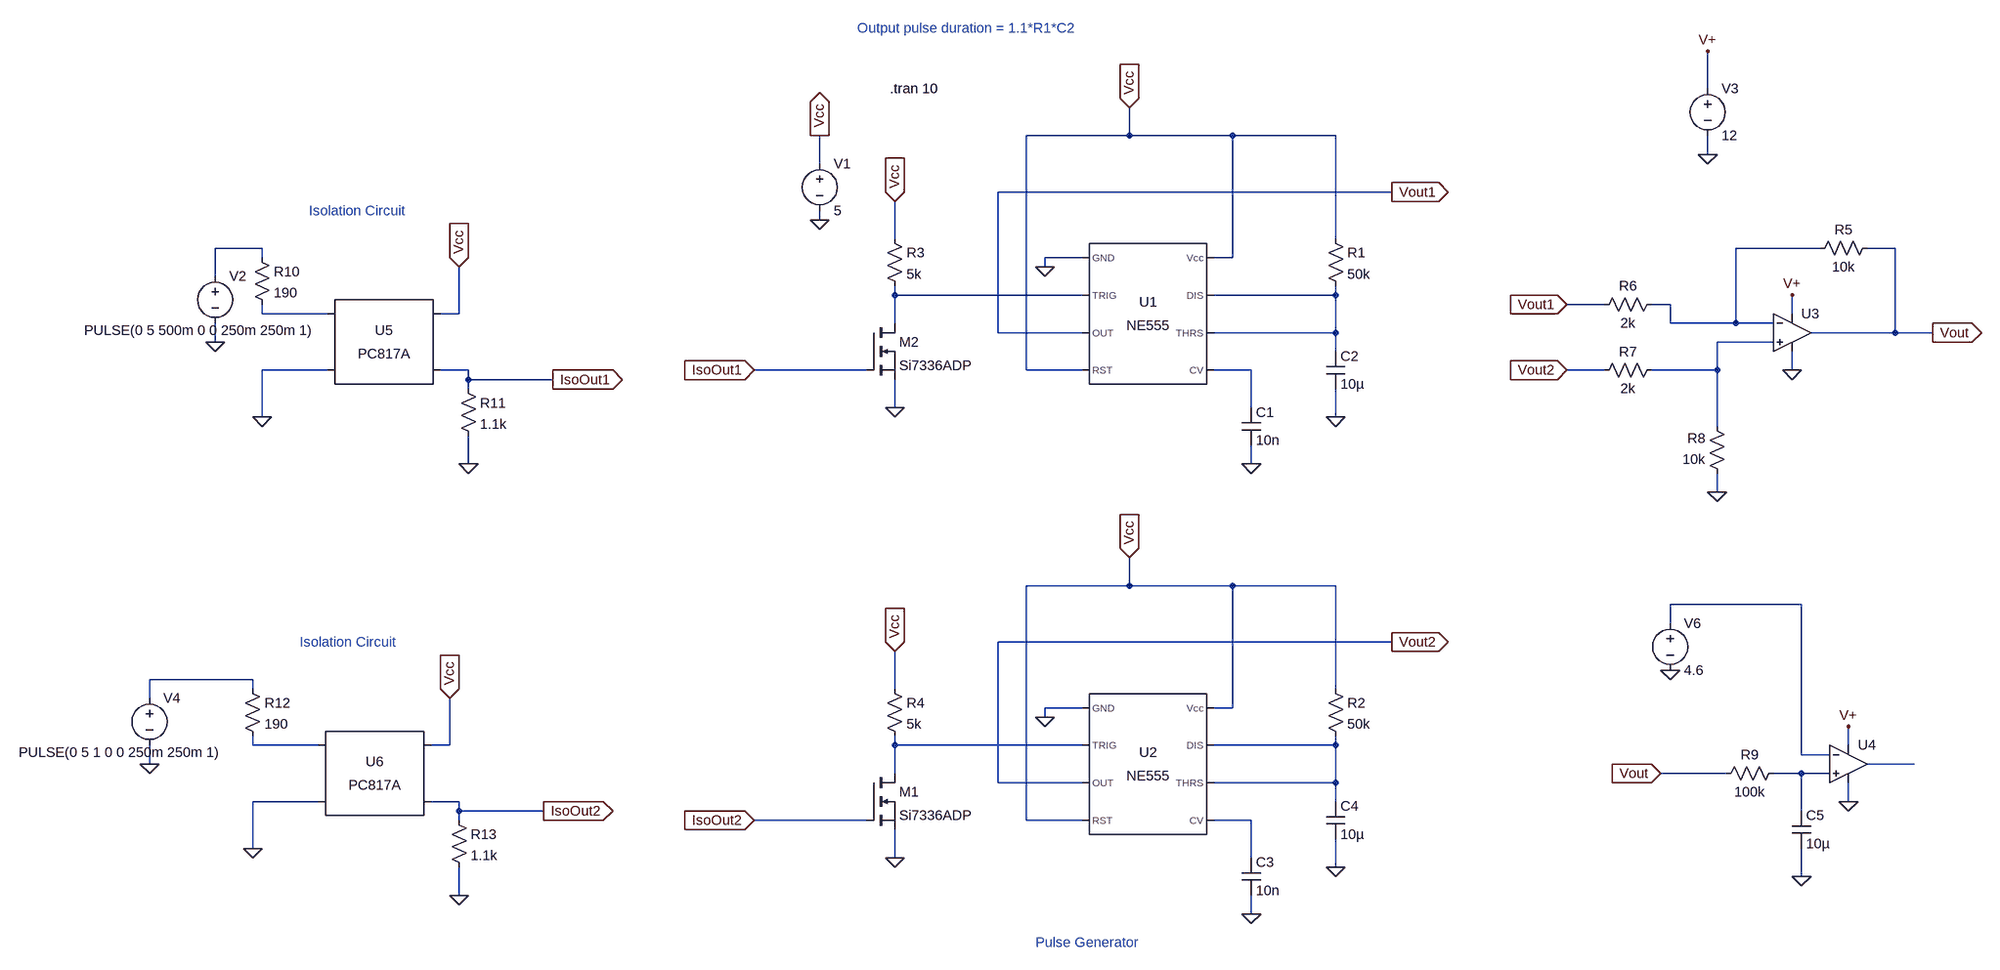
[diagram p0: schematic Relay_Plausibility.asc]
Relay_Plausibility.asc, the LTspice schematic file:
Version 4
SHEET 1 2676 1248
WIRE 1168 -224 1168 -288
WIRE 80 -144 80 -192
WIRE 80 -144 -96 -144
WIRE 256 -144 80 -144
WIRE 432 -144 256 -144
WIRE 1168 -112 1168 -144
WIRE -448 -96 -448 -144
WIRE 528 -48 -144 -48
WIRE -448 0 -448 -16
WIRE -320 32 -320 -32
WIRE 432 32 432 -144
WIRE -1504 48 -1584 48
WIRE 1360 48 1216 48
WIRE 1488 48 1440 48
WIRE -1504 64 -1504 48
WIRE 0 64 -64 64
WIRE 256 64 256 -144
WIRE 256 64 224 64
WIRE -64 80 -64 64
WIRE -1584 96 -1584 48
WIRE -320 128 -320 112
WIRE 0 128 -320 128
WIRE 432 128 432 112
WIRE 432 128 224 128
WIRE 992 144 928 144
WIRE 1104 144 1072 144
WIRE -1504 160 -1504 144
WIRE -1392 160 -1504 160
WIRE -1168 160 -1168 80
WIRE -1168 160 -1200 160
WIRE 1312 160 1312 128
WIRE -320 176 -320 128
WIRE 1104 176 1104 144
WIRE 1216 176 1216 48
WIRE 1216 176 1104 176
WIRE 1280 176 1216 176
WIRE -144 192 -144 -48
WIRE 0 192 -144 192
WIRE 432 192 432 128
WIRE 432 192 224 192
WIRE 1488 192 1488 48
WIRE 1488 192 1344 192
WIRE 1552 192 1488 192
WIRE -1584 208 -1584 176
WIRE 1280 208 1184 208
WIRE 432 224 432 192
WIRE -1392 256 -1504 256
WIRE -1152 256 -1200 256
WIRE -368 256 -560 256
WIRE -96 256 -96 -144
WIRE 0 256 -96 256
WIRE 288 256 224 256
WIRE 992 256 928 256
WIRE 1184 256 1184 208
WIRE 1184 256 1072 256
WIRE 1312 256 1312 224
WIRE -1152 272 -1152 256
WIRE -1008 272 -1152 272
WIRE -1152 288 -1152 272
WIRE -320 320 -320 272
WIRE 288 320 288 256
WIRE -1504 336 -1504 256
WIRE 432 336 432 288
WIRE 1184 352 1184 256
WIRE -1152 416 -1152 368
WIRE 288 416 288 384
WIRE 1184 464 1184 432
WIRE 80 624 80 576
WIRE 80 624 -96 624
WIRE 256 624 80 624
WIRE 432 624 256 624
WIRE 1328 656 1104 656
WIRE 1104 688 1104 656
WIRE 528 720 -144 720
WIRE -1520 784 -1696 784
WIRE -1520 800 -1520 784
WIRE -320 800 -320 736
WIRE 432 800 432 624
WIRE -1696 816 -1696 784
WIRE 0 832 -64 832
WIRE 256 832 256 624
WIRE 256 832 224 832
WIRE -64 848 -64 832
WIRE -1520 896 -1520 880
WIRE -1408 896 -1520 896
WIRE -1184 896 -1184 816
WIRE -1184 896 -1216 896
WIRE -320 896 -320 880
WIRE 0 896 -320 896
WIRE 432 896 432 880
WIRE 432 896 224 896
WIRE 1408 896 1408 864
WIRE 1328 912 1328 656
WIRE 1376 912 1328 912
WIRE -1696 928 -1696 896
WIRE 1520 928 1440 928
WIRE -320 944 -320 896
WIRE 1200 944 1088 944
WIRE 1328 944 1280 944
WIRE 1376 944 1328 944
WIRE -144 960 -144 720
WIRE 0 960 -144 960
WIRE 432 960 432 896
WIRE 432 960 224 960
WIRE -1408 992 -1520 992
WIRE -1168 992 -1216 992
WIRE 432 992 432 960
WIRE 1408 992 1408 960
WIRE -1168 1008 -1168 992
WIRE -1024 1008 -1168 1008
WIRE 1328 1008 1328 944
WIRE -1168 1024 -1168 1008
WIRE -368 1024 -560 1024
WIRE -96 1024 -96 624
WIRE 0 1024 -96 1024
WIRE 288 1024 224 1024
WIRE -1520 1072 -1520 992
WIRE -320 1088 -320 1040
WIRE 288 1088 288 1024
WIRE 432 1104 432 1056
WIRE 1328 1120 1328 1072
WIRE -1168 1152 -1168 1104
WIRE 288 1184 288 1152
FLAG 288 416 0
FLAG -448 0 0
FLAG -448 -144 Vcc
IOPIN -448 -144 Out
FLAG 80 -192 Vcc
IOPIN 80 -192 In
FLAG -64 80 0
FLAG 432 336 0
FLAG -1584 208 0
FLAG 528 -48 Vout1
IOPIN 528 -48 Out
FLAG -320 320 0
FLAG -320 -32 Vcc
IOPIN -320 -32 In
FLAG 288 1184 0
FLAG 80 576 Vcc
IOPIN 80 576 In
FLAG -64 848 0
FLAG 432 1104 0
FLAG -1696 928 0
FLAG 528 720 Vout2
IOPIN 528 720 Out
FLAG -320 1088 0
FLAG -320 736 Vcc
IOPIN -320 736 In
FLAG 1184 464 0
FLAG 928 144 Vout1
IOPIN 928 144 In
FLAG 928 256 Vout2
IOPIN 928 256 In
FLAG 1168 -112 0
FLAG 1168 -288 V+
FLAG 1312 128 V+
FLAG 1552 192 Vout
IOPIN 1552 192 Out
FLAG 1312 256 0
FLAG 1328 1120 0
FLAG 1088 944 Vout
IOPIN 1088 944 In
FLAG 1408 864 V+
FLAG 1408 992 0
FLAG 1104 768 0
FLAG -1504 336 0
FLAG -1168 80 Vcc
IOPIN -1168 80 In
FLAG -1152 416 0
FLAG -1008 272 IsoOut1
IOPIN -1008 272 Out
FLAG -560 256 IsoOut1
IOPIN -560 256 In
FLAG -1520 1072 0
FLAG -1184 816 Vcc
IOPIN -1184 816 In
FLAG -1168 1152 0
FLAG -1024 1008 IsoOut2
IOPIN -1024 1008 Out
FLAG -560 1024 IsoOut2
IOPIN -560 1024 In
SYMBOL Misc\\NE555 112 160 R0
SYMATTR InstName U1
SYMBOL cap 272 320 R0
SYMATTR InstName C1
SYMATTR Value 10n
SYMBOL voltage -448 -112 R0
WINDOW 123 0 0 Left 0
WINDOW 39 0 0 Left 0
SYMATTR InstName V1
SYMATTR Value 5
SYMBOL cap 416 224 R0
SYMATTR InstName C2
SYMATTR Value 10µ
SYMBOL res 416 16 R0
SYMATTR InstName R1
SYMATTR Value 50k
SYMBOL voltage -1584 80 R0
WINDOW 3 -223 108 Left 2
WINDOW 123 0 0 Left 0
WINDOW 39 0 0 Left 0
SYMATTR Value PULSE(0 5 500m 0 0 250m 250m 1)
SYMATTR InstName V2
SYMBOL nmos -368 176 R0
SYMATTR InstName M2
SYMATTR Value Si7336ADP
SYMBOL res -336 16 R0
SYMATTR InstName R3
SYMATTR Value 5k
SYMBOL Misc\\NE555 112 928 R0
SYMATTR InstName U2
SYMBOL cap 272 1088 R0
SYMATTR InstName C3
SYMATTR Value 10n
SYMBOL cap 416 992 R0
SYMATTR InstName C4
SYMATTR Value 10µ
SYMBOL res 416 784 R0
SYMATTR InstName R2
SYMATTR Value 50k
SYMBOL voltage -1696 800 R0
WINDOW 3 -223 108 Left 2
WINDOW 123 0 0 Left 0
WINDOW 39 0 0 Left 0
SYMATTR Value PULSE(0 5 1 0 0 250m 250m 1)
SYMATTR InstName V4
SYMBOL nmos -368 944 R0
SYMATTR InstName M1
SYMATTR Value Si7336ADP
SYMBOL res -336 784 R0
SYMATTR InstName R4
SYMATTR Value 5k
SYMBOL OpAmps\\UniversalOpamp2 1312 192 R0
SYMATTR InstName U3
SYMBOL res 1456 32 R90
WINDOW 0 0 56 VBottom 2
WINDOW 3 32 56 VTop 2
SYMATTR InstName R5
SYMATTR Value 10k
SYMBOL res 1088 128 R90
WINDOW 0 0 56 VBottom 2
WINDOW 3 32 56 VTop 2
SYMATTR InstName R6
SYMATTR Value 2k
SYMBOL res 1088 240 R90
WINDOW 0 0 56 VBottom 2
WINDOW 3 32 56 VTop 2
SYMATTR InstName R7
SYMATTR Value 2k
SYMBOL res 1200 448 R180
WINDOW 0 36 76 Left 2
WINDOW 3 36 40 Left 2
SYMATTR InstName R8
SYMATTR Value 10k
SYMBOL voltage 1168 -240 R0
WINDOW 123 0 0 Left 0
WINDOW 39 0 0 Left 0
SYMATTR InstName V3
SYMATTR Value 12
SYMBOL res 1296 928 R90
WINDOW 0 0 56 VBottom 2
WINDOW 3 32 56 VTop 2
SYMATTR InstName R9
SYMATTR Value 100k
SYMBOL cap 1312 1008 R0
SYMATTR InstName C5
SYMATTR Value 10µ
SYMBOL OpAmps\\UniversalOpamp2 1408 928 R0
SYMATTR InstName U4
SYMBOL voltage 1104 672 R0
WINDOW 123 0 0 Left 0
WINDOW 39 0 0 Left 0
SYMATTR InstName V6
SYMATTR Value 4.6
SYMBOL Optos\\PC817A -1296 208 R0
SYMATTR InstName U5
SYMBOL res -1520 48 R0
SYMATTR InstName R10
SYMATTR Value 190
SYMBOL res -1168 272 R0
SYMATTR InstName R11
SYMATTR Value 1.1k
SYMBOL Optos\\PC817A -1312 944 R0
SYMATTR InstName U6
SYMBOL res -1536 784 R0
SYMATTR InstName R12
SYMATTR Value 190
SYMBOL res -1184 1008 R0
SYMATTR InstName R13
SYMATTR Value 1.1k
TEXT -384 -328 Left 2 ;Output pulse duration = 1.1*R1*C2
TEXT -328 -224 Left 2 !.tran 10
TEXT -1424 -16 Left 2 ;Isolation Circuit
TEXT -1440 720 Left 2 ;Isolation Circuit
TEXT -80 1232 Left 2 ;Pulse Generator

The netlist it stands for:
* Relay_Plausibility.asc
XU1 0 N003 Vout1 Vcc N007 N004 N004 Vcc NE555  ; pins GND TRIG OUT RST CV THRS DIS Vcc
C1 N007 0 10n
V1 Vcc 0 5
C2 N004 0 10µ
R1 Vcc N004 50k
V2 N001 0 PULSE(0 5 500m 0 0 250m 250m 1)
M2 N003 IsoOut1 0 0 Si7336ADP
R3 Vcc N003 5k
XU2 0 N011 Vout2 Vcc N015 N012 N012 Vcc NE555  ; pins GND TRIG OUT RST CV THRS DIS Vcc
C3 N015 0 10n
C4 N012 0 10µ
R2 Vcc N012 50k
V4 N009 0 PULSE(0 5 1 0 0 250m 250m 1)
M1 N011 IsoOut2 0 0 Si7336ADP
R4 Vcc N011 5k
XU3 N006 N002 V+ 0 Vout level.2 Avol=1Meg GBW=10Meg Slew=10Meg ilimit=25m rail=0 Vos=0 phimargin=45 en=0 enk=0 in=0 ink=0 Rin=500Meg  ; pins IN+ IN- V+ V- OUT
R5 Vout N002 10k
R6 N002 Vout1 2k
R7 N006 Vout2 2k
R8 0 N006 10k
V3 V+ 0 12
R9 N014 Vout 100k
C5 N014 0 10µ
XU4 N014 N008 V+ 0 N013 level.2 Avol=1Meg GBW=10Meg Slew=10Meg ilimit=25m rail=0 Vos=0 phimargin=45 en=0 enk=0 in=0 ink=0 Rin=500Meg  ; pins IN+ IN- V+ V- OUT
V6 N008 0 4.6
XU5 N005 0 Vcc IsoOut1 PC817 Igain=1m
R10 N001 N005 190
R11 IsoOut1 0 1.1k
XU6 N010 0 Vcc IsoOut2 PC817 Igain=1m
R12 N009 N010 190
R13 IsoOut2 0 1.1k
.model NMOS NMOS
.model PMOS PMOS
.lib standard.mos
* Output pulse duration = 1.1*R1*C2
.tran 10
* Isolation Circuit
* Isolation Circuit
* Pulse Generator
.lib NE555.sub
.lib UniversalOpamps2.sub
.lib PC817.sub
.backanno
.end